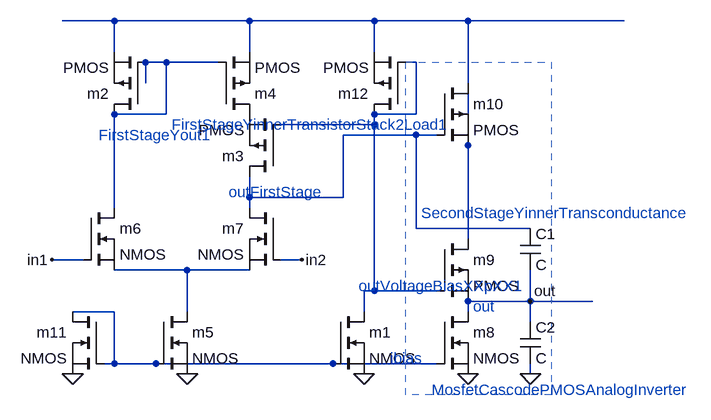
[diagram p0: schematic schematic.asc]
schematic.asc, the LTspice schematic file:
Version 4
SHEET 1 880 680
WIRE -272 -240 -352 -240
WIRE -64 -240 -272 -240
WIRE 128 -240 -64 -240
WIRE 272 -240 128 -240
WIRE 512 -240 272 -240
WIRE -272 -192 -272 -240
WIRE -64 -192 -64 -240
WIRE 128 -192 128 -240
WIRE -192 -176 -224 -176
WIRE -112 -176 -192 -176
WIRE 192 -176 176 -176
WIRE -224 -144 -224 -176
WIRE 272 -144 272 -240
WIRE -192 -96 -192 -176
WIRE -192 -96 -272 -96
WIRE 192 -96 192 -176
WIRE 192 -96 128 -96
WIRE 128 -80 128 -96
WIRE 128 -80 -16 -80
WIRE 192 -64 80 -64
WIRE 224 -64 192 -64
WIRE 272 -48 272 -128
WIRE -64 32 -64 0
WIRE 80 32 80 -64
WIRE 80 32 -64 32
WIRE -272 48 -272 -96
WIRE -64 48 -64 32
WIRE 192 80 192 -64
WIRE 368 80 192 80
WIRE 272 96 272 -48
WIRE -320 128 -368 128
WIRE 16 128 -16 128
WIRE -160 144 -272 144
WIRE -64 144 -160 144
WIRE 128 176 128 -80
WIRE 128 176 112 176
WIRE 224 176 128 176
WIRE 368 192 368 144
WIRE 368 192 272 192
WIRE 464 192 368 192
WIRE -272 208 -336 208
WIRE -160 208 -160 144
WIRE 112 208 112 176
WIRE 272 208 272 192
WIRE 368 224 368 192
WIRE -272 288 -272 208
WIRE -272 288 -288 288
WIRE -208 288 -272 288
WIRE 64 288 -208 288
WIRE 224 288 64 288
WIRE 368 304 368 288
FLAG 272 304 0
FLAG -368 128 in1
FLAG 16 128 in2
FLAG -336 304 0
FLAG -160 304 0
FLAG 112 304 0
FLAG 368 192 out
FLAG 368 304 0
SYMBOL pmos 224 96 R0
SYMATTR InstName m9
SYMBOL pmos 224 -144 R0
SYMATTR InstName m10
SYMBOL nmos 224 208 R0
SYMATTR InstName m8
SYMBOL nmos -320 48 R0
SYMATTR InstName m6
SYMBOL nmos -16 48 M0
SYMATTR InstName m7
SYMBOL pmos -224 -96 R180
SYMATTR InstName m2
SYMBOL pmos -112 -96 M180
SYMATTR InstName m4
SYMBOL nmos -288 208 M0
SYMATTR InstName m11
SYMBOL nmos -208 208 R0
SYMATTR InstName m5
SYMBOL nmos 64 208 R0
SYMATTR InstName m1
SYMBOL cap 352 80 R0
SYMATTR InstName C1
SYMBOL cap 352 224 R0
SYMATTR InstName C2
SYMBOL pmos 176 -96 R180
SYMATTR InstName m12
SYMBOL pmos -16 0 R180
SYMATTR InstName m3
TEXT -96 24 Left 0 ;outFirstStage
TEXT 200 56 Left 0 ;SecondStageYinnerTransconductance
TEXT 104 168 Left 0 ;outVoltageBiasXXpXX1
TEXT 280 200 Left 0 ;out
TEXT 152 280 Left 0 ;ibias
TEXT 216 328 Left 0 ;MosfetCascodePMOSAnalogInverter
TEXT -296 -64 Left 0 ;FirstStageYout1
TEXT -184 -80 Left 0 ;FirstStageYinnerTransistorStack2Load1
RECTANGLE Normal 400 336 176 -176 2

The netlist it stands for:
* schematic.asc
m9 N005 N003 out out PMOS
m10 N001 N004 N005 N005 PMOS
m8 out N007 0 0 NMOS
m6 N002 in1 N006 N006 NMOS
m7 N004 in2 N006 N006 NMOS
m2 N002 N002 N001 N001 PMOS
m4 P001 N002 N001 N001 PMOS
m11 N007 N007 0 0 NMOS
m5 N006 N007 0 0 NMOS
m1 N003 N007 0 0 NMOS
C1 N004 out C
C2 out 0 C
m12 N003 N003 N001 N001 PMOS
m3 N004 N003 P001 P001 PMOS
.model NMOS NMOS
.model PMOS PMOS
.lib standard.mos
* outFirstStage
* SecondStageYinnerTransconductance
* outVoltageBiasXXpXX1
* out
* ibias
* MosfetCascodePMOSAnalogInverter
* FirstStageYout1
* FirstStageYinnerTransistorStack2Load1
.backanno
.end